# Altium schematic sheet FPGA_Memec_XC9500XV_Demo_Board.SchDoc: Example for Memec XC9500XV Demo Board
size B; Organization: Altium Limited; Address1: L3, 12a Rodborough Rd; Address2: Frenchs Forest; Address3: NSW; Address4: Australia 2086; DocumentNumber: 1; SheetNumber: 1; SheetTotal: 1
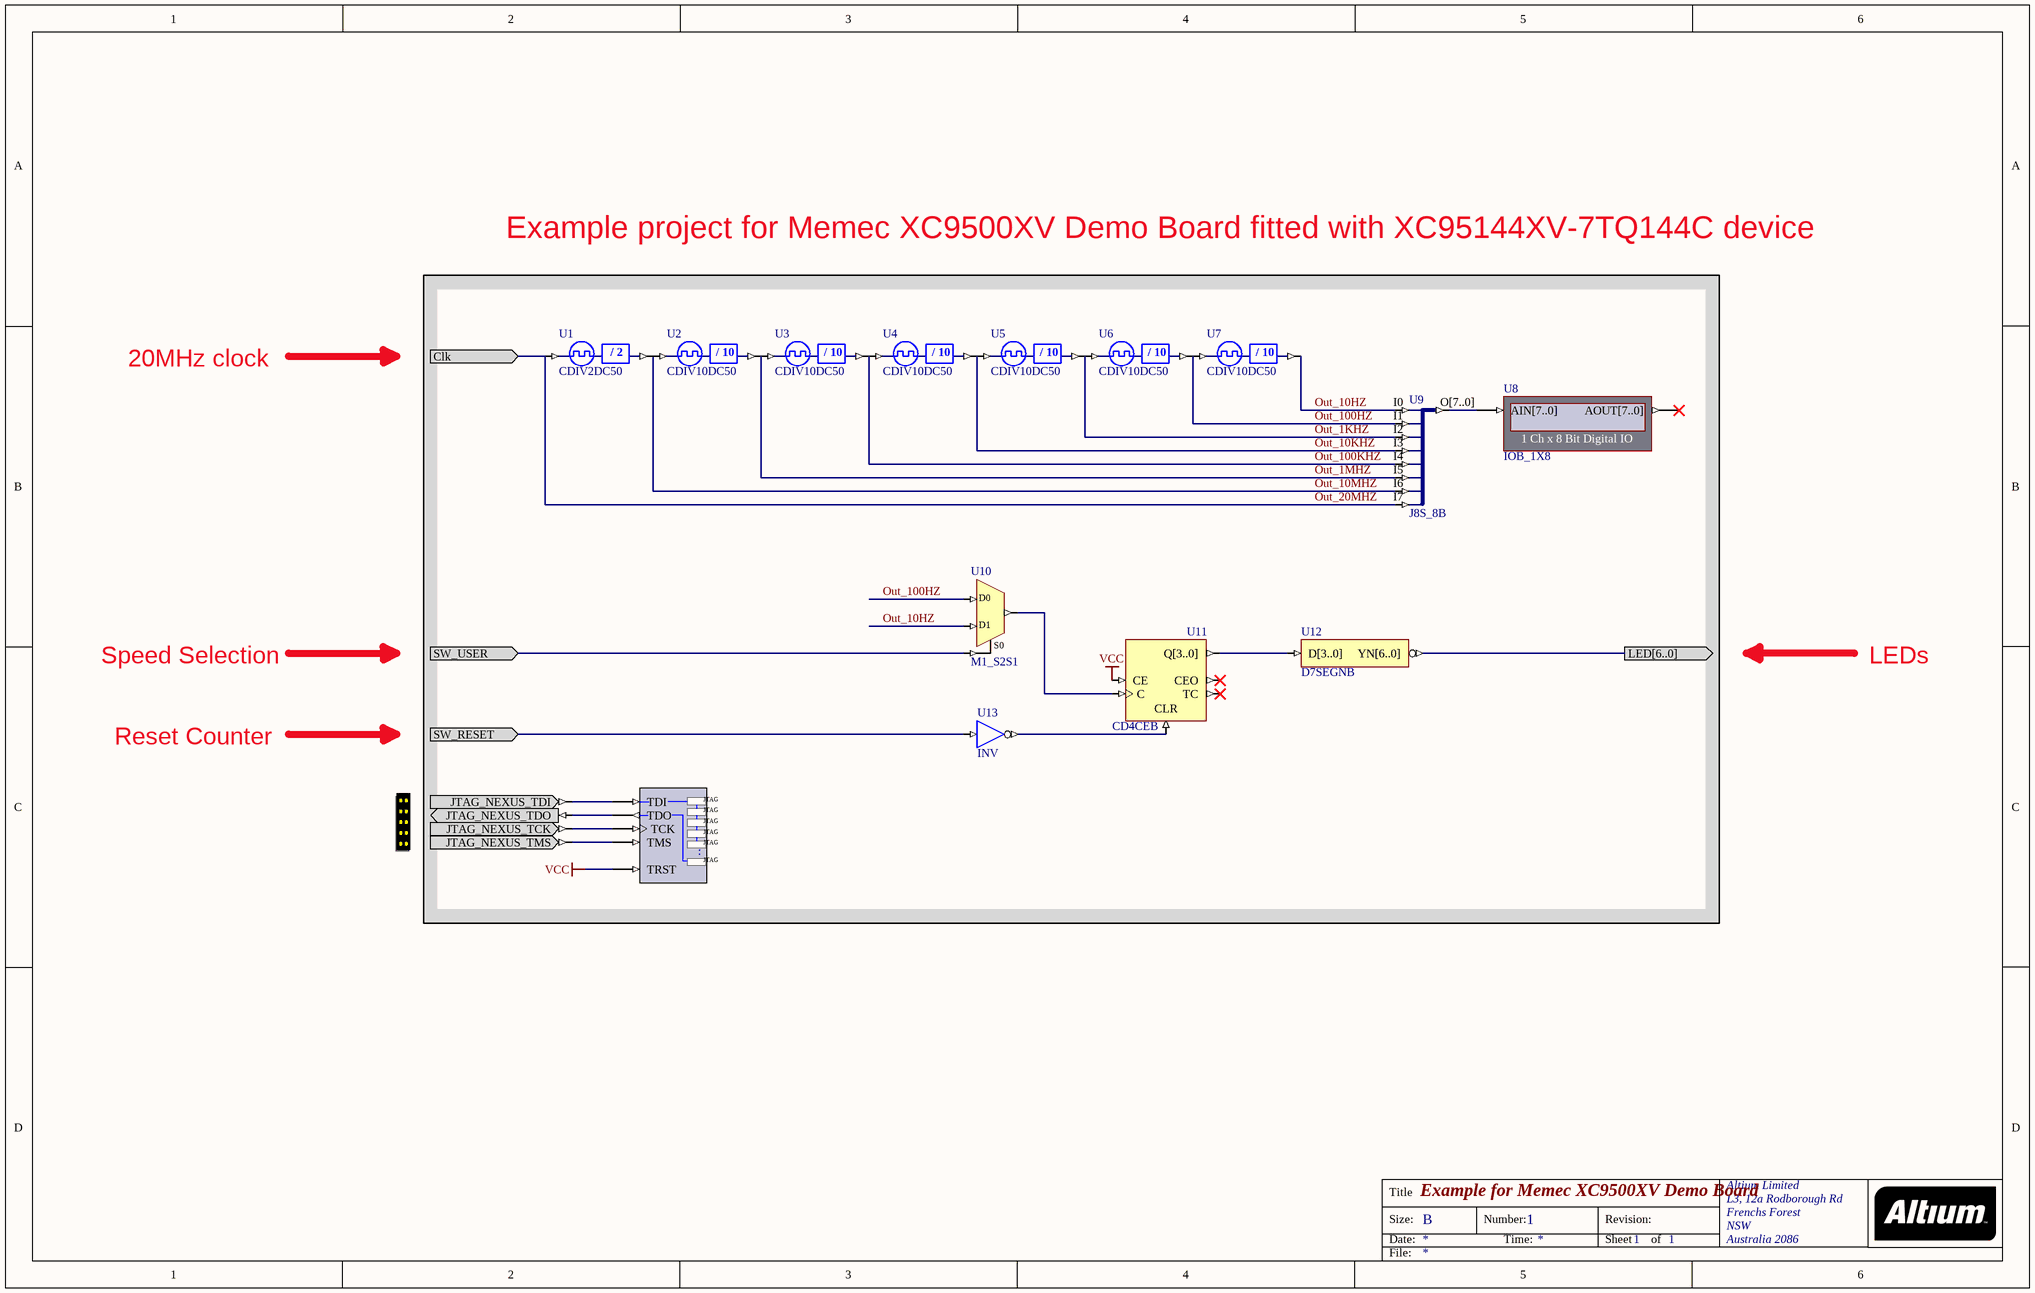
[diagram p0: FPGA_Memec_XC9500XV_Demo_Board.SchDoc]

## Parts
?  NEXUS_JTAG_CONNECTOR  (value not drawn)
NEXUS_JTAG_PORT  NEXUS_JTAG_PORT  (value not drawn)
U1  CDIV2DC50
U2  CDIV10DC50
U3  CDIV10DC50
U4  CDIV10DC50
U5  CDIV10DC50
U6  CDIV10DC50
U7  CDIV10DC50
U8  IOB_1X8
U9  J8S_8B
U10  M1_S2S1
U11  CD4CEB
U12  D7SEGNB
U13  INV

## Ports
Clk (in), LED[6..0] (out), SW_RESET (in), SW_USER (in)

## Nets
VCC: NEXUS_JTAG_PORT.TRST U11.CE
LED[6..0]: U12.YN[6..0] ; port LED[6..0]
Out_1KHZ: U5.CLKDV U6.CLKIN U9.I2
Out_1MHZ: U2.CLKDV U3.CLKIN U9.I5
Out_10HZ: U7.CLKDV U9.I0 U10.D1
Out_10KHZ: U4.CLKDV U5.CLKIN U9.I3
Out_10MHZ: U1.CLKDV U2.CLKIN U9.I6
Out_20MHZ: U1.CLKIN U9.I7 ; port Clk
Out_100HZ: U6.CLKDV U7.CLKIN U9.I1 U10.D0
Out_100KHZ: U3.CLKDV U4.CLKIN U9.I4
SW_RESET: U13.I ; port SW_RESET
SW_USER: U10.S0 ; port SW_USER
Net?_JTAG_NEXUS_TCK: ?.JTAG_NEXUS_TCK NEXUS_JTAG_PORT.TCK
Net?_JTAG_NEXUS_TDI: ?.JTAG_NEXUS_TDI NEXUS_JTAG_PORT.TDI
Net?_JTAG_NEXUS_TDO: ?.JTAG_NEXUS_TDO NEXUS_JTAG_PORT.TDO
Net?_JTAG_NEXUS_TMS: ?.JTAG_NEXUS_TMS NEXUS_JTAG_PORT.TMS
NetU8_AIN[7..0]: U8.AIN[7..0] U9.O[7..0]
NetU10_O: U10.O U11.C
NetU11_CLR: U11.CLR U13.O
NetU11_Q[3..0]: U11.Q[3..0] U12.D[3..0]

Not connected (* = marked no-connect by the designer): U8 AOUT[7..0]*; U11 CEO* TC*

## Notes on the sheet
- Example project for Memec XC9500XV Demo Board fitted with XC95144XV-7TQ144C device
- 20MHz clock
- LEDs
- Speed Selection
- Reset Counter
- Title
- Size:
- Date:
- B
- Number:
- Time:
- Revision:
- Sheet
- of
- File:
- (in symbol CDIV2DC50) / 2
- (in symbol CDIV10DC50) / 10
- (in symbol NEXUS_JTAG_PORT) JTAG; .

## Library data of the parts
? = NEXUS_JTAG_CONNECTOR: JTAG Port; PortComponent: True; Published: 19-Nov-2003; Publisher: Altium Limited
NEXUS_JTAG_PORT = NEXUS_JTAG_PORT: Nexus Processor JTAG Chain Connector; NEXUS_JTAG_CONNECTOR: True; Published: 18-Nov-2003; Publisher: Altium Limited
U1 = CDIV2DC50: Clock Divider by 2 with 50% Duty Cycle Output; Xilinx Equivalent: CLK_DIV2; ArchiveName: GENERIC; Published: 4-Dec-2003; Publisher: Altium Limited; Core Revision: 1.00.00
U2-U7 = CDIV10DC50: Clock Divider by 10 with 50% Duty Cycle Output; ArchiveName: GENERIC; Xilinx Equivalent: CLK_DIV10; Published: 4-Dec-2003; Publisher: Altium Limited; Core Revision: 1.00.00
U8 = IOB_1X8: 1 Ch x 8 Bit Digital IO; NEXUS_CORE: Instrument; NEXUS_JTAG_DEVICE: True; NEXUS_JTAG_ORDER: 0; Published: 30/09/2003; Publisher: Altium Hobart Technology Centre; Core Revision: 1.00.00
U9 = J8S_8B: 8 Single pin inputs to single 8-Bit output bus; ArchiveName: GENERIC; Published: 18-Dec-2003; Publisher: Altium Limited; Core Revision: 1.00.00
U10 = M1_S2S1: 2x1-Single Wire to 1x1-Single Wire Multiplexer; Xilinx Equivalent: M2_1; ArchiveName: GENERIC; Published: 4-Dec-2003; Publisher: Altium Limited; Core Revision: 1.00.00
U11 = CD4CEB: 4-Bit Cascadable BCD Counter with Clock Enable and Asynchronous Clear, Bus Version; ArchiveName: GENERIC; Published: 4-Dec-2003; Publisher: Altium Limited; Core Revision: 1.00.00
U12 = D7SEGNB: 7-Segment-Display Decoder for Common-Anode LED (Active Low Output), Bus Version; SubClass: 7SEGN; PortSize: 7; ArchiveName: GENERIC; VHDLIB_SIM: GENERIC_LIB; Published: 29-Jan-2004; Publisher: Altium Limited; LastRevisionNo: 1.00.00; HelpURL: CR0118 FPGA Generic Library Guide.pdf#page=162; FunctionalClass: Decoder; PortStyle: Bus Version
U13 = INV: Inverter; ArchiveName: GENERIC; Published: 4-Dec-2003; Publisher: Altium Limited; Xilinx Equivalent: INV; Core Revision: 1.00.00